# Altium schematic sheet STM32.SchDoc
size A4; SheetNumber: 5; SheetTotal: 6
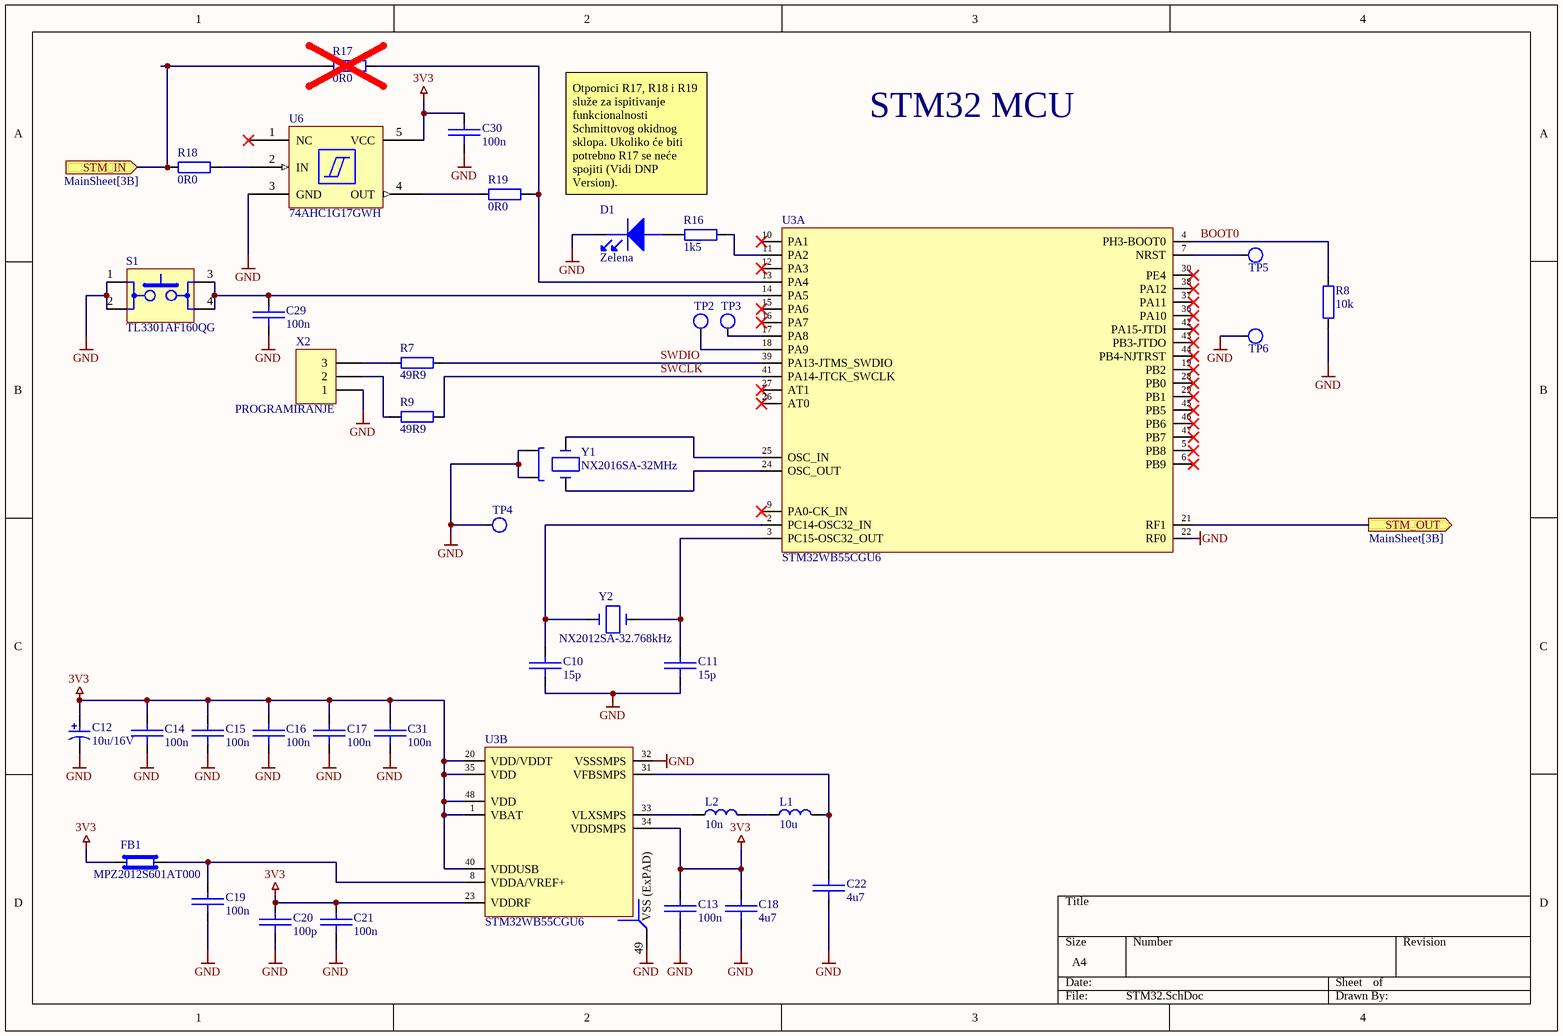
[diagram p0: STM32.SchDoc]

## Parts
C10  15p  [0805]
C11  15p  [0805]
C12  10u/16V  [1210]
C13  100n  [0805]
C14  100n  [0805]
C15  100n  [0805]
C16  100n  [0805]
C17  100n  [0805]
C18  4u7  [0805]
C19  100n  [0805]
C20  100p  [0402]
C21  100n  [0805]
C22  4u7  [0805]
C29  100n  [0805]
C30  100n  [0805]
C31  100n  [0805]
D1  Zelena  [0805]
FB1  MPZ2012S601AT000  [0805]
L1  10u  [0805]
L2  10n  [0805]
R7  49R9  [0805]
R8  10k  [0805]
R9  49R9  [0805]
R16  1k5  [0805]
R17  0R0  [0603]
R18  0R0  [0603]
R19  0R0  [0603]
S1  TL3301AF160QG  [SOP400P1000X525-4N]
TP2  TEST_POINT  [TST_POINT]  (value not drawn)  (no BOM)
TP3  TEST_POINT  [TST_POINT]  (value not drawn)  (no BOM)
TP4  TEST_POINT  [TST_POINT]  (value not drawn)  (no BOM)
TP5  TEST_POINT  [TST_POINT]  (value not drawn)  (no BOM)
TP6  TEST_POINT  [TST_POINT]  (value not drawn)  (no BOM)
U3  STM32WB55CGU6  [STM32]  (parts A,B of 2)
U6  74AHC1G17GWH  [SOT353-1]
X2  PROGRAMIRANJE  [HDR1X3]
Y1  NX2016SA-32MHz  [NX2016_4P]
Y2  NX2012SA-32.768kHz  [0805]

## Ports
STM_IN (in, see MainSheet[3B]), STM_OUT (out, see MainSheet[3B])

## Nets
3V3: C12.1 C13.2 C14.2 C15.2 C16.2 C17.2 C18.2 C20.2 C21.2 C30.2 C31.2 FB1.1 U3.1(VBAT) U3.20(VDD/VDDT) U3.23(VDDRF) U3.34(VDDSMPS) U3.35(VDD) U3.40(VDDUSB) U3.48(VDD) U6.5(VCC)
GND: C10.1 C11.1 C12.2 C13.1 C14.1 C15.1 C16.1 C17.1 C18.1 C19.1 C20.1 C21.1 C22.1 C29.1 C30.1 C31.1 D1.1(Cathode) R8.2 S1.1 S1.2 TP4.1 TP6.1 U3.22(RF0) U3.32(VSSSMPS) U3.49(VSS_(ExPAD)) U6.3(GND) X2.1 Y1.2(GND) Y1.4(GND)
BOOT0: R8.1 U3.4(PH3-BOOT0)
STM_IN: R17.1 R18.1 ; port STM_IN
STM_OUT: U3.21(RF1) ; port STM_OUT
SWCLK: R9.2 U3.41(PA14-JTCK_SWCLK)
SWDIO: R7.2 U3.39(PA13-JTMS_SWDIO)
NetC10_2: C10.2 U3.2(PC14-OSC32_IN) Y2.2
NetC11_2: C11.2 U3.3(PC15-OSC32_OUT) Y2.1
NetC19_2: C19.2 FB1.2 U3.8(VDDA/VREF+)
NetC22_2: C22.2 L1.2 U3.31(VFBSMPS)
NetC29_2: C29.2 S1.3 S1.4 U3.14(PA5)
NetD1_2: D1.2(Anode) R16.1
NetL1_1: L1.1 L2.2
NetL2_1: L2.1 U3.33(VLXSMPS)
NetR7_1: R7.1 X2.3
NetR9_1: R9.1 X2.2
NetR16_2: R16.2 U3.11(PA2)
NetR17_2: R17.2 R19.2 U3.13(PA4)
NetR18_2: R18.2 U6.2(IN)
NetR19_1: R19.1 U6.4(OUT)
NetTP2_1: TP2.1 U3.18(PA9)
NetTP3_1: TP3.1 U3.17(PA8)
NetTP5_1: TP5.1 U3.7(NRST)
NetU3_24: U3.24(OSC_OUT) Y1.1
NetU3_25: U3.25(OSC_IN) Y1.3

Not connected (* = marked no-connect by the designer): U3 5(PB8)* 6(PB9)* 9(PA0-CK_IN)* 10(PA1)* 12(PA3)* 15(PA6)* 16(PA7)* 19(PB2)* 26(AT0)* 27(AT1)* 28(PB0)* 29(PB1)* 30(PE4)* 36(PA10)* 37(PA11)* 38(PA12)* 42(PA15-JTDI)* 43(PB3-JTDO)* 44(PB4-NJTRST)* 45(PB5)* 46(PB6)* 47(PB7)*; U6 1(NC)*

## Notes on the sheet
- STM32 MCU
- Otpornici R17, R18 i R19 služe za ispitivanje funkcionalnosti Schmittovog okidnog sklopa. Ukoliko će biti potrebno R17 se neće spojiti (Vidi DNP Version).

## Library data of the parts
C10 C11 = 08052U150JAT2A: Kondenzator, C0G, 10%, 160VDC; Manufacturer: Murata; Manufacturer Part Number: GRM21A5C2D150JW01D; Capacitance: 15pF; Value: 15pF; Supplier 1: Mouser; Category: Ceramic Capacitors; Case/Package: 0805; ComponentLink1Description: http://components.arrow.com/part/dataview/0323_07284744?src-supplier=Arrow+Europe; Supplier Part Number 1: 81-GRM21A5C2D150JW1D; Supplier 2: Mouser; Supplier Part Number 2: 581-08052U150J; Kučište: 0805
C12 = 581-THJB106K016SJN: Elektrolitski kondenzator, Ta, 10%, 16V; Supplier 1: DigiKey; Supplier Part Number 1: 478-13152-1-ND; Case/Package: 1210
C13-C17 C19 C21 C29-C31 = MCJCU21GBB7104KTPA01: Kondenzator, X7R, 10%, 50VDC; Manufacturer: TDK; Manufacturer Part Number: C2012X7R1H104K125AE; Capacitance: 100nF; Value: 100nF; Supplier 1: Mouser; Case/Package: 0805; ComponentLink1Description: https://datasheet.ciiva.com/29534/mlcc-commercial-soft-en-29534235.pdf?src-supplier=Digi-Key; Supplier Part Number 1: 963-MCJCU21GBB7104KT; Category: Ceramic Capacitors; Supplier 2: Mouser; Supplier Part Number 2: 810-C2012X7R1H104KAE; Kučište: 0805
C18 C22 = CGA4J1X7R1H475K125AC: Kondenzator, C0G, 10%, 50VDC; Manufacturer: TDK; Capacitance: 4u7F; Value: 4u7F; Supplier 1: Mouser; Manufacturer Part Number: CGA4J1X7R1H475K125AC; ComponentLink1Description: https://product.tdk.com/info/en/catalog/datasheets/mlcc_automotive_general_en.pdf?src-supplier=Digi-Key; Supplier Part Number 1: 810-CGA4J1X7R1H475K1; Category: Ceramic Capacitors; Case/Package: 0805; Kučište: 0805
C20 = GCM1555C2A101GE02D: Kondenzator, C0G, 2%, 100VDC; Kučište: 0402; Supplier 1: DigiKey; Supplier Part Number 1: 490-GCM1555C2A101GE02DTR-ND; Case/Package: 0402
D1 = SM0805GCL: Dioda, svjetleća, 1,9V; Manufacturer: Bivar; Supplier 1: Mouser; Manufacturer Part Number: SM0805GCL; Category: LEDs; Case/Package: 0805; ComponentLink1Description: https://datasheet.ciiva.com/16487/sm0805gcl-16487554.pdf?src-supplier=Future+Electronics; Supplier Part Number 1: 749-SM0805GCL; Kučište: 0805
FB1 = MPZ2012S601AT000: Feritna perla, 600Ohm; Manufacturer: TDK; Supplier 1: Mouser; Manufacturer Part Number: MPZ2012S601AT000; Category: Inductors; Case/Package: 0805; ComponentLink1Description: https://datasheet.ciiva.com/46634/beads-commercial-power-mpz-en-46634335.pdf?src-supplier=Digi-Key; Supplier Part Number 1: 810-MPZ2012S601AT000; Kučište: 0805
L1 = LSQBA201212T100KR: Zavojnica, neoklopljena, 500mADC,; Manufacturer: Murata; Manufacturer Part Number: LQM21FN100M70L; Value: 10uH; Supplier 1: Avnet; Category: Fixed Inductors; Case/Package: 0805; ComponentLink1Description: https://datasheet.ciiva.com/18088/getdatasheetpartid-74214-18088963.pdf?src-supplier=Verical; Supplier Part Number 1: LQM21FN100M70L; Supplier 2: Mouser; Supplier Part Number 2: 81-LQM21FN100M70L; Kučište: 0805
L2 = AIMC-0805-10NJ-T: Zavojnica, neoklopljena, +/-5%, 300mADC; Manufacturer: Abracon; Value: 10nH; Power Dissipation: 62.5mW; Temperature Coefficient: 400ppm/°C; Voltage Rating: 50V; Supplier 1: Mouser; Manufacturer Part Number: AIMC-0805-10NJ-T; Category: Fixed Inductors; Case/Package: 0805; ComponentLink1Description: https://datasheet.octopart.com:443/MCMR04X000-PTL-Multicomp-datasheet-10850617.pdf?src-supplier=IHS; Supplier Part Number 1: 815-AIMC-0805-10NJT; Supplier: Farnell; Supplier Part Number: 2692041; RoHS: Compliant; Stock: 490000; Pricing: 10000=0.0033, 50000=0.0029 (GBP); Case Code (Imperial): 0402; Case Code (Metric): 1005; Composition: Ceramic; Contact Plating: Tin; Lifecycle Status: Production; Max Operating Temperature: 155°C; Min Operating Temperature: -55°C; Mounting Technology: Surface Mount; Number of Terminals: 2; Packaging: Cut Tape; Power Rating: 62.5mW; REACH SVHC: No; Voltage Rating (DC): 50V; ComponentLink1URL: https://datasheet.octopart.com:443/MCMR04X000-PTL-Multicomp-datasheet-10850617.pdf?src-supplier=IHS; ComponentLink2URL: https://datasheet.octopart.com:443/MCMR04X000-PTL-Multicomp-datasheet-99731353.pdf?src-supplier=Farnell; ComponentLink2Description: https://datasheet.octopart.com:443/MCMR04X000-PTL-Multicomp-datasheet-99731353.pdf?src-supplier=Farnell; ComponentLink3URL: https://datasheet.octopart.com:443/MCMR04X000-PTL-Multicomp-datasheet-15896274.pdf?src-supplier=Newark; ComponentLink3Description: https://datasheet.octopart.com:443/MCMR04X000-PTL-Multicomp-datasheet-15896274.pdf?src-supplier=Newark; Kučište: 0805
R7 R9 = AC0805FR-0749R9L: Otpornik, ±100ppm/C, 125mW; Manufacturer: Yageo; Value: 49,9; Supplier 1: Mouser; Manufacturer Part Number: AC0805FR-0749R9L; Category: Chip SMD Resistors; Case/Package: 0805; ComponentLink1Description: http://www.yageo.com/NewPortal/yageodocoutput?fileName=/pdf/R-Chip/PYu-AC_51_RoHS_L_6.pdf&src-supplier=Digi-Key; Supplier Part Number 1: 603-AC0805FR-0749R9L; Kučište: 0805
R8 = RC0805JR-0710KL: Otpornik, 5%, 125mW; Manufacturer: Yageo; Supplier 1: Mouser; Manufacturer Part Number: RC0805JR-0710KL; Category: Chip SMD Resistors; Case/Package: 0805; ComponentLink1Description: https://datasheet.ciiva.com/7983/444164-7983765.pdf?src-supplier=Element14; Supplier Part Number 1: 603-RC0805JR-0710KL; Value: 10k; Kučište: 0805
R16 = MCU08050C1501FP5: Otpornik, ±50ppm/C, 100mW; ComponentLink5URL: https://datasheet.octopart.com:443/CRCW12061K50JNEA-Vishay-datasheet-21226360.pdf?src-supplier=Newark; ComponentLink5Description: https://datasheet.octopart.com:443/CRCW12061K50JNEA-Vishay-datasheet-21226360.pdf?src-supplier=Newark; ComponentLink8URL: https://datasheet.octopart.com:443/CRCW12061K50JNEA-Vishay-datasheet-24897302.pdf?src-supplier=Farnell; ComponentLink8Description: https://datasheet.octopart.com:443/CRCW12061K50JNEA-Vishay-datasheet-24897302.pdf?src-supplier=Farnell; ComponentLink9URL: https://datasheet.octopart.com:443/CRCW12061K50JNEA-Vishay-datasheet-62316122.pdf?src-supplier=Future+Electronics; ComponentLink9Description: https://datasheet.octopart.com:443/CRCW12061K50JNEA-Vishay-datasheet-62316122.pdf?src-supplier=Future+Electronics; ComponentLink10URL: https://datasheet.octopart.com:443/CRCW12061K50JNEA-Vishay-datasheet-5300368.pdf?src-supplier=Future+Electronics; ComponentLink10Description: https://datasheet.octopart.com:443/CRCW12061K50JNEA-Vishay-datasheet-5300368.pdf?src-supplier=Future+Electronics; ComponentLink11URL: https://datasheet.octopart.com:443/CRCW12061K50JNEA-Vishay-datasheet-137115460.pdf?src-supplier=X-ON; ComponentLink11Description: https://datasheet.octopart.com:443/CRCW12061K50JNEA-Vishay-datasheet-137115460.pdf?src-supplier=X-ON; ComponentLink12URL: https://datasheet.octopart.com:443/CRCW12061K50JNEA-Vishay-Dale-datasheet-47688880.pdf?src-supplier=RS+(Formerly+Allied+Electronics); ComponentLink12Description: https://datasheet.octopart.com:443/CRCW12061K50JNEA-Vishay-Dale-datasheet-47688880.pdf?src-supplier=RS+(Formerly+Allied+Electronics); ComponentLink13URL: https://datasheet.octopart.com:443/CRCW12061K50JNEA-Vishay-datasheet-12001583.pdf?src-supplier=RS+(Formerly+Allied+Electronics); ComponentLink13Description: https://datasheet.octopart.com:443/CRCW12061K50JNEA-Vishay-datasheet-12001583.pdf?src-supplier=RS+(Formerly+Allied+Electronics); ComponentLink14URL: https://datasheet.octopart.com:443/CRCW12061K50JNEA-Vishay-datasheet-5306405.pdf?src-supplier=RS+(Formerly+Allied+Electronics); ComponentLink14Description: https://datasheet.octopart.com:443/CRCW12061K50JNEA-Vishay-datasheet-5306405.pdf?src-supplier=RS+(Formerly+Allied+Electronics); ComponentLink15URL: https://datasheet.octopart.com:443/CRCW12061K50JNEA-Vishay-datasheet-11540273.pdf?src-supplier=Arrow+Electronics; ComponentLink15Description: https://datasheet.octopart.com:443/CRCW12061K50JNEA-Vishay-datasheet-11540273.pdf?src-supplier=Arrow+Electronics; ComponentLink16URL: https://datasheet.octopart.com:443/CRCW12061K50JNEA-Vishay-datasheet-8445837.pdf?src-supplier=element14; ComponentLink16Description: https://datasheet.octopart.com:443/CRCW12061K50JNEA-Vishay-datasheet-8445837.pdf?src-supplier=element14; ComponentLink17URL: https://datasheet.octopart.com:443/CRCW12061K50JNEA-Vishay-datasheet-5377184.pdf?src-supplier=Garrett; ComponentLink17Description: https://datasheet.octopart.com:443/CRCW12061K50JNEA-Vishay-datasheet-5377184.pdf?src-supplier=Garrett; ComponentLink18URL: https://datasheet.octopart.com:443/CRCW12061K50JNEA-Vishay-datasheet-148188.pdf?src-supplier=Garrett; ComponentLink18Description: https://datasheet.octopart.com:443/CRCW12061K50JNEA-Vishay-datasheet-148188.pdf?src-supplier=Garrett; ComponentLink19URL: https://datasheet.octopart.com:443/CRCW12061K50JNEA-Vishay-datasheet-41916.pdf?src-supplier=Garrett; ComponentLink19Description: https://datasheet.octopart.com:443/CRCW12061K50JNEA-Vishay-datasheet-41916.pdf?src-supplier=Garrett; ComponentLink20URL: http://sigma.octopart.com:80/rohs_statement/Vishay-company-15.pdf?src-supplier=Compliance+Statements; ComponentLink20Description: http://sigma.octopart.com:80/rohs_statement/Vishay-company-15.pdf?src-supplier=Compliance+Statements; Parameter 1: *; Kučište: 0805; Supplier 1: Farnell; Supplier Part Number 1: MCU08050C1501FP500; Case/Package: 0805
R17-R19 = CRCW06030000Z0EA: Otpornik, 1%, 100mW; Kučište: 0402; Supplier 1: Farnell; Supplier Part Number 1: MCMR04X000 PTL; Case/Package: 0603
S1 = TL3301AF160QG: Taktilni prekidač; Manufacturer: E-Switch; Supplier 1: Mouser; Manufacturer Part Number: TL3301AF160QG; Category: Tactile Switches; ComponentLink1Description: https://datasheet.ciiva.com/2900/p010516d-2900775.pdf?src-supplier=Digi-Key; Supplier Part Number 1: 612-TL3301AF1; Case/Package: SMD-4, 6x6mm
U3 = STM32WB55CGU6: STM32 Mikrokontroler, 1,7-3,6V; Manufacturer: STMicroelectronics; Supplier 1: Mouser; Manufacturer Part Number: STM32WB55CGU6; ComponentLink1Description: http://www.farnell.com/datasheets/2792352.pdf?src-supplier=Farnell; Supplier Part Number 1: 511-STM32WB55CGU6; Category: Microcontroller; Case/Package: UFQFPN-48
U6 = 74AHC1G17GWH: Integrirani Schmittov okidni sklop; Kučište: 0805; Supplier 1: Farnell; Supplier Part Number 1: 74AHC1G17GWH; Case/Package: SOT353-1
X2 = Header 3: Header, 3-Pin; LatestRevisionDate: 17-Jul-2002; LatestRevisionNote: Re-released for DXP Platform.; Publisher: Altium Limited
Y1 = NX2012SA32768K1: Kristalni oscilator 32KHz; Manufacturer: NDK; Manufacturer Part Number: NX2016SA-32MHZ-EXS00A-CS10925; Kučište: 0805; Supplier 1: DigiKey; Supplier Part Number 1: 644-1375-1-ND; Category: Crystal; Supplier 2: Mouser; Supplier Part Number 2: 344-NX2016SA32S06465; Case/Package: 0805
Y2 = NX2012SA-32.768K-STD-MUB-1: Kristalni oscilator, 32.768KHz; Manufacturer: NDK; Manufacturer Part Number: NX2012SA-32.768KHZ-EXS00A-MU00626; Case/Package: 0805; Category: Crystal; Supplier 1: Mouser; Supplier Part Number 1: 344-NX2012SA32768K1; Kučište: 0805